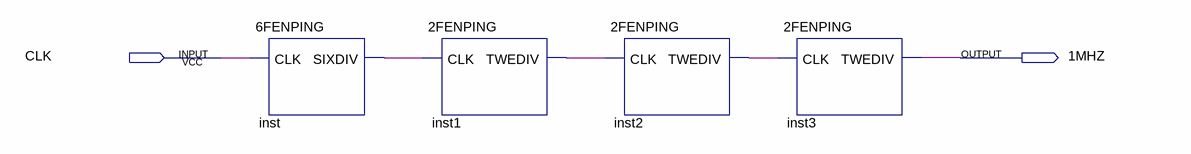
[diagram p0: schematic sheet]
// Quartus schematic 1MHZ.bdf as structural Verilog: 4 symbols, 2 pins
module \1MHZ  (
  input  CLK,
  output \1MHZ 
);

  wire inst1_twediv, inst2_twediv, inst_sixdiv;

  \6FENPING  inst (.CLK(CLK), .SIXDIV(inst_sixdiv));
  \2FENPING  inst1 (.CLK(inst_sixdiv), .TWEDIV(inst1_twediv));
  \2FENPING  inst2 (.CLK(inst1_twediv), .TWEDIV(inst2_twediv));
  \2FENPING  inst3 (.CLK(inst2_twediv), .TWEDIV(\1MHZ ));
endmodule
